# EAGLE design Arduino_Nano_Countdown_Timer_7-seg_CC (EAGLE 9.6.2)
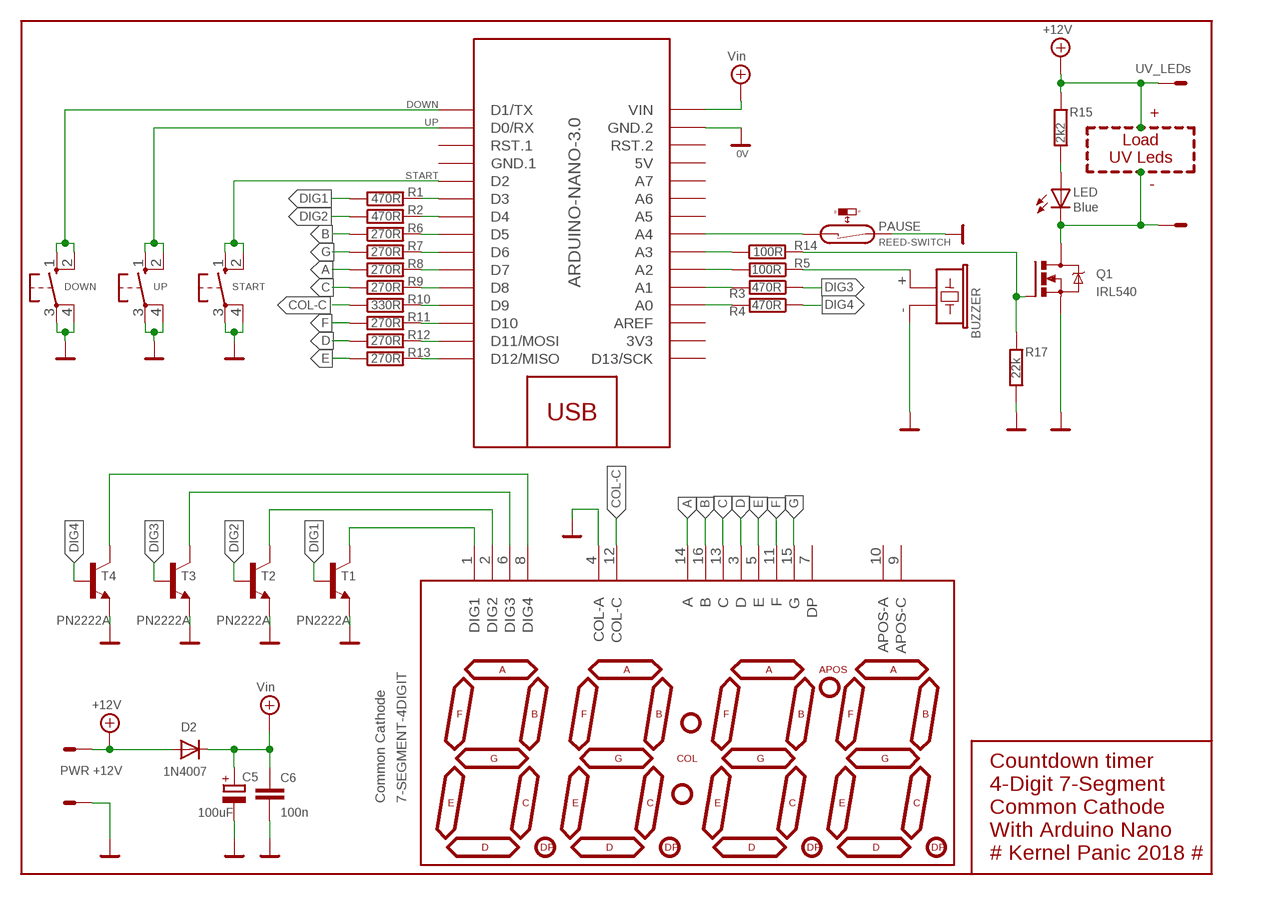
[diagram p0: schematic, sheet 1]

## Parts
BUZZER  F/CM12P  [F/CM12P]
C5  100uF  CAPACITOR_POLE5-6.5  [E5-6.5]
C6  100n  CAPACITOR050-025X075  [C050-025X075]
D2  1N4007  DIODE1N4004  [DO41-10]
DOWN  SWITCHE6K  [DTE6K]
LED  Blue  LED3MM  [LED3MM]
LED2  7-SEGMENT-4DIGIT  [7-SEGMENT-4DIGIT]
LOAD  UV_LEDs  22-23-2021  [22-23-2021]
M2  ARDUINO-NANO-3.0  [ARDUINO-NANO-3.0]
PAUSE  REED-SWITCH  REED-SWITCH-2PIN  [2PIN_HEADER]
PWR  PWR +12V  22-23-2021  [22-23-2021]
Q1  IRL540  IRF540  [TO220BV]
R1  470R  RESISTORR0805  [R0805]
R2  470R  RESISTORR0805  [R0805]
R3  470R  RESISTORR0805  [R0805]
R4  470R  RESISTORR0805  [R0805]
R5  100R  RESISTORR0805  [R0805]
R6  270R  RESISTORR0805  [R0805]
R7  270R  RESISTORR0805  [R0805]
R8  270R  RESISTORR0805  [R0805]
R9  270R  RESISTORR0805  [R0805]
R10  330R  RESISTORR0805  [R0805]
R11  270R  RESISTORR0805  [R0805]
R12  270R  RESISTORR0805  [R0805]
R13  270R  RESISTORR0805  [R0805]
R14  100R  RESISTOR0207/10-OCTAGON  [0207/10-8]
R15  2k2  RESISTORR0805  [R0805]
R17  22k  RESISTORR0805  [R0805]
START  SWITCHE6K  [DTE6K]
T1  PN2222A  2N2222  [TO92-EBC-OVAL]
T2  PN2222A  2N2222  [TO92-EBC-OVAL]
T3  PN2222A  2N2222  [TO92-EBC-OVAL]
T4  PN2222A  2N2222  [TO92-EBC-OVAL]
UP  SWITCHE6K  [DTE6K]

## Nets
0V: BUZZER.- C5.- C6.2 DOWN.3(P) DOWN.4(P) LED2.4(COL-A) M2.J2.2(GND.2) PAUSE.2 PWR.1 Q1.S R17.2 START.3(P) START.4(P) T1.E T2.E T3.E T4.E UP.3(P) UP.4(P)
+12V: D2.A LOAD.1 PWR.2 R15.1
A: LED2.14(A) R8.1
B: LED2.16(B) R6.1
BUZZER: BUZZER.+ R5.1
C: LED2.13(C) R9.1
COL-C: LED2.12(COL-C) R10.1
D: LED2.3(D) R12.1
DG1: LED2.1(DIG1) T1.C
DG2: LED2.2(DIG2) T2.C
DG3: LED2.6(DIG3) T3.C
DG4: LED2.8(DIG4) T4.C
DIG1: R1.1 T1.B
DIG2: R2.1 T2.B
DIG3: R3.1 T3.B
DIG4: R4.1 T4.B
DOWN: DOWN.1(S) DOWN.2(S) M2.J1.1(D1/TX)
DP: M2.J1.12(D9) R10.2
DRAIN: LED.K(C) LOAD.2 Q1.D
E: LED2.5(E) R13.1
F: LED2.11(F) R11.1
G: LED2.15(G) R7.1
GATE: Q1.G R14.2 R17.1
LED: LED.A R15.2
N$1: M2.J1.15(D12/MISO) R13.2
N$2: M2.J1.14(D11/MOSI) R12.2
N$3: M2.J2.10(A2) R5.2
N$4: M2.J2.9(A3) R14.1
N$5: M2.J1.13(D10) R11.2
N$6: M2.J1.6(D3) R1.2
N$12: M2.J2.11(A1) R3.2
N$13: M2.J1.7(D4) R2.2
N$14: M2.J2.8(A4) PAUSE.1
N$15: M2.J2.12(A0) R4.2
N$16: M2.J1.11(D8) R9.2
N$21: M2.J1.10(D7) R8.2
N$22: M2.J1.9(D6) R7.2
N$23: M2.J1.8(D5) R6.2
START: M2.J1.5(D2) START.1(S) START.2(S)
UP: M2.J1.2(D0/RX) UP.1(S) UP.2(S)
VIN: C5.+ C6.1 D2.C M2.J2.1(VIN) ; supply symbol labelled Vin
Unconnected: LED2.7(DP) LED2.9(APOS-C) LED2.10(APOS-A) M2.J1.3(RST.1) M2.J2.3(RST.2) M2.J2.5(A7) M2.J2.6(A6) M2.J2.7(A5) M2.J2.13(AREF) M2.J2.15(D13/SCK)

## Notes on the sheet
- +
- Load
  UV Leds
- -
- Common Cathode
- Countdown timer
  4-Digit 7-Segment
  Common Cathode
  With Arduino Nano
  # Kernel Panic 2018 #

## Power pins joined to a net without a drawn wire
3V3: M2.J2.14(3V3)
5V: M2.J2.4(5V)
GND.1: M2.J1.4(GND.1)

## Library data of the parts
BUZZER = buzzer:F/CM12P: BUZZER Source: Buerklin; OC_FARNELL: unknown; OC_NEWARK: unknown
C5 = 1_Stavros:CAPACITOR_POL: POLARIZED CAPACITOR, European symbol
C6 = 1_Stavros:CAPACITOR: CAPACITOR, European symbol
D2 = 1_Stavros:DIODE: Diode SMADIODE - SMA Surface Mount Package 20V 1A Schottky Diode Digikey: 641-1014-6-ND DO-1N4148 - Through Hole Small Current Diode SOD-123 20V 1 A (.5mV Vf) Schottky Diode - Digikey: MBRX120TPMSCT-ND SOD-323 10V 570mA (.38mV Vf, 3ns) Schottky Diode - Digikey: ZLLS410CT-ND SOD-523 30V 30mA Schottky Diode (RB751S-40TE61) - Digikey: RB751S-40TE61CT-ND SOT23-R/W - SOT23 Package (R = Solder Paste/Reflow Ovens, W = Hand-Soldering) BAT54Film 40V 300mA - Digikey: 497-7162-1-ND
DOWN START UP = 1_Stavros:SWITCH: ITT SWITCH
LED = 1_My_Library:LED: LED OSRAM: - CHIPLED LG R971, LG N971, LY N971, LG Q971, LY Q971, LO R971, LY R971 LH N974, LH R974 LS Q976, LO Q976, LY Q976 LO Q996 - Hyper CHIPLED LW Q18S LB Q993, LB Q99A, LB R99A - SideLED LS A670, LO A670, LY A670, LG A670, LP A670 LB A673, LV A673, LT A673, LW A673 LH A674 LY A675 LS A676, LA A676, LO A676, LY A676, LW A676 LS A679, LY A679, LG A679 - Hyper Micro SIDELED® LS Y876, LA Y876, LO Y876, LY Y876 LT Y87S - SmartLED LW L88C, LW L88S LB L89C, LB L89S, LG L890 LS L89K, LO L89K, LY L89K LS L896, LA L896, LO L896, LY L896 - TOPLED LS T670, LO T670, LY T670, LG T670, LP T670 LSG T670, LSP T670, LSY T670, LOP T670, LYG T670 LG T671, LOG T671, LSG T671 LB T673, LV T673, LT T673, LW T673 LH T674 LS T676, LA T676, LO T676, LY T676, LB T676, LH T676, LSB T676, LW T676 LB T67C, LV T67C, LT T67C, LS T67K, LO T67K, LY T67K, LW E67C LS E67B, LA E67B, LO E67B, LY E67B, LB E67C, LV E67C, LT E67C LW T67C LS T679, LY T679, LG T679 LS T770, LO T770, LY T770, LG T770, LP T770 LB T773, LV T773, LT T773, LW T773 LH T774 LS E675, LA E675, LY E675, LS T675 LS T776, LA T776, LO T776, LY T776, LB T776 LHGB T686 LT T68C, LB T68C - Hyper Mini TOPLED® LB M676 - Mini TOPLED Santana® LG M470 LS M47K, LO M47K, LY M47K Source: http://www.osram.convergy.de/
LED2 = 1_My_Library:7-SEGMENT-4DIGIT: This is a part for the 4-Digit 7-segment LEDs from Young Sun
LOAD PWR = Connector-Molex_Stavros:22-23-2021: .100" (2.54mm) Center Header - 2 Pin; MF: MOLEX; MPN: 22-23-2021; OC_FARNELL: 1462926; OC_NEWARK: 25C3832
M2 = diy-modules:ARDUINO-NANO-3.0: Arduino Nano 3.0
PAUSE = MY_Switch-misc:REED-SWITCH-: Reed Sensor
Q1 = transistor-power:IRF540: HEXFET Power MOSFET
R1-R15 = 1_My_Library:RESISTOR: RESISTOR, European symbol
R17 = 1_Stavros:RESISTOR: RESISTOR, European symbol
T1-T4 = 1_My_Library:2N2222: NPN TRANSISTOR Big oval pads

## Board
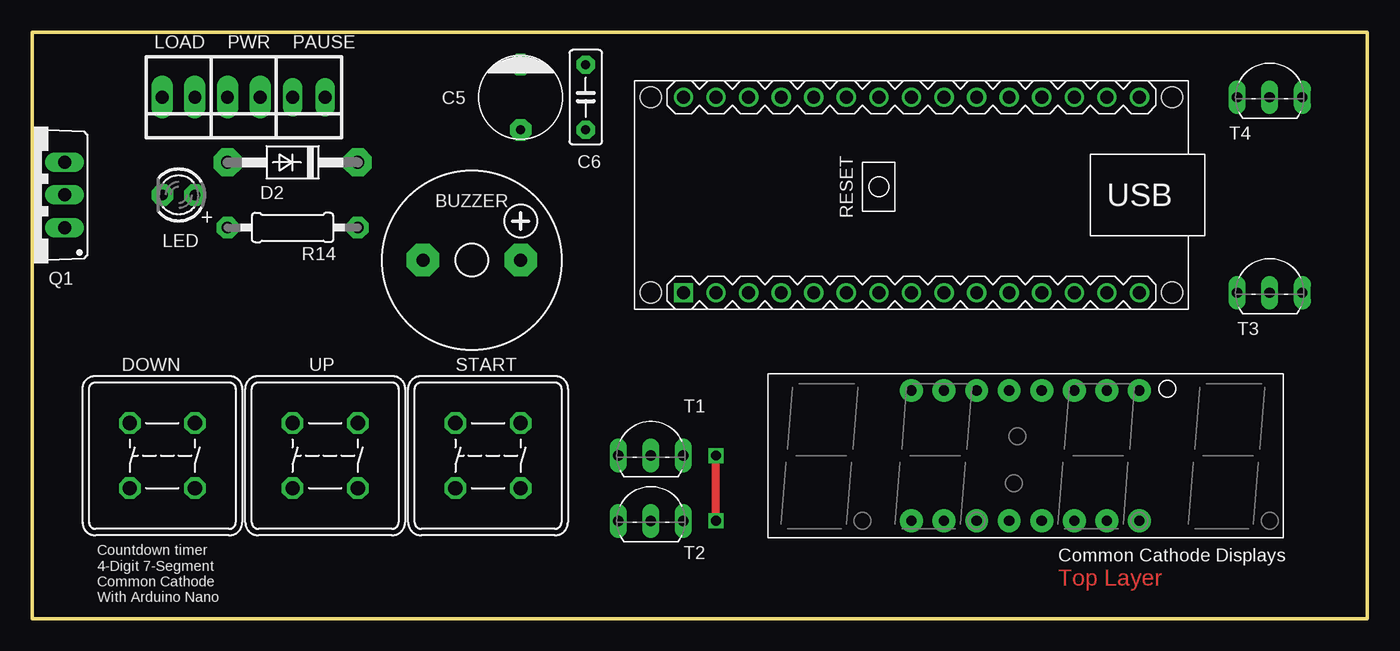
[diagram p1: board, top side]
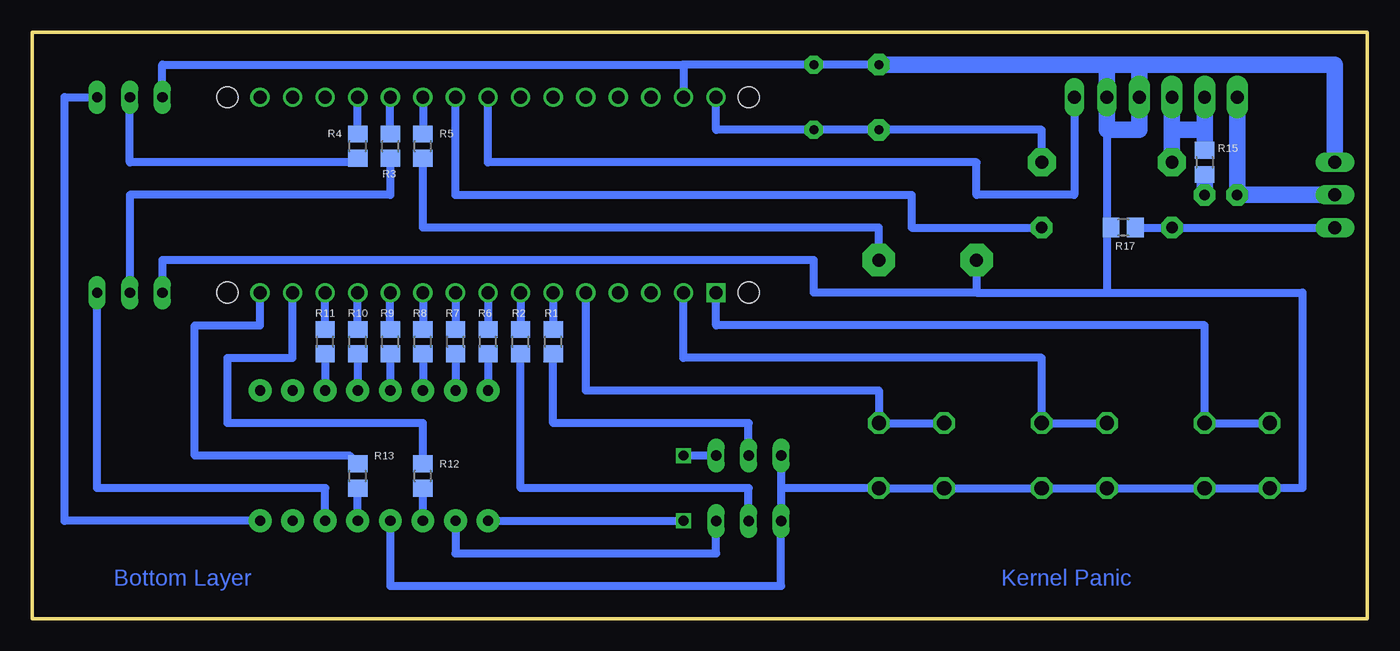
[diagram p2: board, bottom side, seen from below]

Size 104.14 x 45.72 mm. Coordinates in mm from the lower left corner, seen from the top.
Outline: 0,0 104.14,0 104.14,45.72 0,45.72 0,0
Copper layers (1*16): Top 0.035mm / dielectric 1.5mm / Bottom 0.035mm
Design rules "default": minimum track width 10mil, minimum drill 24mil, track to track 8mil, track to pad 8mil, pad to pad 8mil, via to via 8mil, smd to smd 8mil, copper to edge 40mil, drill to drill 8mil, minimum pad ring 10mil, minimum via ring 8mil, stop-mask expansion 4mil, vias tented up to drill 0mil, thermal gap 10mil

### Footprints (pad centres in the part's own frame; a part is rotated, then mirrored left to right if it is on the bottom)
F/CM12P = drill 1.016 pad 2.54 octagon: + 3.81,0; - -3.81,0
E5-6.5 = drill 0.7 pad 1.676 octagon: + -2.54,0; - 2.54,0
C050-025X075 = drill 0.7 pad 1.422 octagon: 1 -2.54,0; 2 2.54,0
DO41-10 = drill 1 pad 2.184 octagon: A 5.08,0; C -5.08,0
DTE6K = drill 1.118 octagon: 1 -2.54,2.54; 2 2.54,2.54; 3 2.54,-2.54; 4 -2.54,-2.54
LED3MM = drill 0.8 pad 1.676 octagon: A -1.27,0; K 1.27,0
7-SEGMENT-4DIGIT = drill 0.8 pad 1.778: 1 -8.89,-5.08; 2 -6.35,-5.08; 3 -3.81,-5.08; 4 -1.27,-5.08; 5 1.27,-5.08; 6 3.81,-5.08; 7 6.35,-5.08; 8 8.89,-5.08; 9 8.89,5.08; 10 6.35,5.08; 11 3.81,5.08; 12 1.27,5.08; 13 -1.27,5.08; 14 -3.81,5.08; 15 -6.35,5.08; 16 -8.89,5.08
22-23-2021 = drill 1 pad 1.676 long: 1 -1.27,0; 2 1.27,0
ARDUINO-NANO-3.0 = drill 1 square: J1.1 17.78,7.62 | drill 1: J1.2 15.24,7.62; J1.3 12.7,7.62; J1.4 10.16,7.62; J1.5 7.62,7.62; J1.6 5.08,7.62; J1.7 2.54,7.62; J1.8 0,7.62; J1.9 -2.54,7.62; J1.10 -5.08,7.62; J1.11 -7.62,7.62; J1.12 -10.16,7.62; J1.13 -12.7,7.62; J1.14 -15.24,7.62; J1.15 -17.78,7.62; J2.1 17.78,-7.62; J2.2 15.24,-7.62; J2.3 12.7,-7.62; J2.4 10.16,-7.62; J2.5 7.62,-7.62; J2.6 5.08,-7.62; J2.7 2.54,-7.62; J2.8 0,-7.62; J2.9 -2.54,-7.62; J2.10 -5.08,-7.62; J2.11 -7.62,-7.62; J2.12 -10.16,-7.62; J2.13 -12.7,-7.62; J2.14 -15.24,-7.62; J2.15 -17.78,-7.62 | hole 1.651: -20.32,7.62; -20.32,-7.62; 20.32,-7.62; 20.32,7.62
2PIN_HEADER = drill 1 long: 1 -1.27,0; 2 1.27,0
TO220BV = drill 1.016 long: D 0,-2.54; G -2.54,-2.54; S 2.54,-2.54
R0805 = smd 1.3 x 1.5: 1 -0.95,0; 2 0.95,0
0207/10-8 = drill 0.9 pad 1.676 octagon: 1 -5.08,0; 2 5.08,0
TO92-EBC-OVAL = drill 0.813 long: B 0,-1.27; C 2.54,-1.27; E -2.54,-1.27

### Placement (x,y rotation side)
BUZZER  34.29,27.94 0 top
C5  38.1,40.64 90 top
C6  43.18,40.64 90 top
D2  20.32,35.56 180 top
DOWN  10.16,12.7 0 top
LED  11.43,33.02 180 top
LED2  77.47,12.7 0 top
LOAD  11.43,40.64 180 top
M2  68.58,33.02 180 top
PAUSE  21.59,40.64 180 top
PWR  16.51,40.64 180 top
Q1  0,33.02 90 top
R1  63.5,21.59 90 bottom
R2  66.04,21.59 90 bottom
R3  76.2,36.83 90 bottom
R4  78.74,36.83 90 bottom
R5  73.66,36.83 90 bottom
R6  68.58,21.59 90 bottom
R7  71.12,21.59 90 bottom
R8  73.66,21.59 90 bottom
R9  76.2,21.59 90 bottom
R10  78.74,21.59 90 bottom
R11  81.28,21.59 90 bottom
R12  73.66,11.11 90 bottom
R13  78.74,11.11 90 bottom
R14  20.32,30.48 180 top
R15  12.7,35.56 270 bottom
R17  19.05,30.48 180 bottom
START  35.56,12.7 0 top
T1  48.26,13.97 0 top
T2  48.26,8.89 0 top
T3  96.52,26.67 0 top
T4  96.52,41.91 0 top
UP  22.86,12.7 0 top

### Tracks (layer width: path | path; a pad name or v marks a point on that pad's centre or on a via)
0V
  Bottom 0.61: C5.- C6.2 53.34,43.18 | T1.E 45.72,10.16 | 45.72,10.16 T2.E 45.72,2.54 76.2,2.54 LED2.4 | 45.72,10.16 START.3 START.4 UP.3 UP.4 DOWN.3 DOWN.4 5.08,10.16 5.08,25.4 20.32,25.4 | 53.34,43.18 M2.J2.2 | 20.32,38.1 20.32,30.48 | 20.32,30.48 20.32,30.16 | 20.32,30.16 20.32,25.4 | 30.48,25.4 20.32,25.4 | BUZZER.- 30.48,25.4 | 30.48,25.4 43.18,25.4 43.18,27.94 93.98,27.94 T3.E | T4.E 93.98,43.18 53.34,43.18 | 20.32,30.48 R17.2 20.32,30.16
  Bottom 1.27: Q1.S 2.54,43.18 17.78,43.18 | 17.78,43.18 20.32,43.18 | 20.32,43.18 C5.- | 20.32,43.18 PAUSE.2 20.32,38.1 17.78,38.1 PWR.1 17.78,43.18
+12V
  Bottom 1.27: R15.1 12.7,38.1 | 12.7,38.1 LOAD.1 | PWR.2 15.24,38.1 | 15.24,38.1 D2.A | 12.7,38.1 15.24,38.1
A
  Bottom 0.61: R8.1 LED2.14
B
  Bottom 0.61: R6.1 LED2.16
BUZZER
  Bottom 0.61: R5.1 73.66,30.48 38.1,30.48 BUZZER.+
C
  Bottom 0.61: R9.1 LED2.13
COL-C
  Bottom 0.61: R10.1 LED2.12
D
  Bottom 0.61: LED2.3 R12.1
DG1  (via drill 0.75)
  Top 0.61: v53.34,7.62 v53.34,12.7
  Bottom 0.61: LED2.1 v53.34,7.62 | T1.C v53.34,12.7
DG2
  Bottom 0.61: LED2.2 71.12,5.08 50.8,5.08 T2.C
DG3
  Bottom 0.61: LED2.6 81.28,10.16 99.06,10.16 T3.C
DG4
  Bottom 0.61: LED2.8 101.6,7.62 101.6,40.64 T4.C
DIG1
  Bottom 0.61: T1.B 48.26,15.24 63.5,15.24 R1.1
DIG2
  Bottom 0.61: T2.B 48.26,10.16 66.04,10.16 R2.1
DIG3
  Bottom 0.61: R3.1 76.2,33.02 96.52,33.02 T3.B
DIG4
  Bottom 0.61: R4.1 79.06,35.56 96.52,35.56 T4.B
DOWN
  Bottom 0.61: M2.J1.1 50.8,22.86 12.7,22.86 DOWN.2 DOWN.1
DP
  Bottom 0.61: R10.2 M2.J1.12
DRAIN
  Bottom 1.27: LOAD.2 LED.K Q1.D
E
  Bottom 0.61: LED2.5 R13.1
F
  Bottom 0.61: R11.1 LED2.11
G
  Bottom 0.61: R7.1 LED2.15
GATE
  Bottom 0.61: Q1.G R14.2 R17.1
LED
  Bottom 1.27: LED.A R15.2
N$1
  Bottom 0.61: R13.2 79.38,12.7 91.44,12.7 91.44,22.86 86.36,22.86 M2.J1.15
N$2
  Bottom 0.61: R12.2 73.66,15.24 88.9,15.24 88.9,20.32 83.82,20.32 M2.J1.14
N$3
  Bottom 0.61: M2.J2.10 R5.2
N$4
  Bottom 0.61: M2.J2.9 71.12,33.02 35.56,33.02 35.56,30.48 R14.1
N$5
  Bottom 0.61: R11.2 M2.J1.13
N$6
  Bottom 0.61: M2.J1.6 R1.2
N$12
  Bottom 0.61: R3.2 M2.J2.11
N$13
  Bottom 0.61: M2.J1.7 R2.2
N$14
  Bottom 0.61: PAUSE.1 22.86,33.02 30.48,33.02 30.48,35.56 68.58,35.56 M2.J2.8
N$15
  Bottom 0.61: R4.2 M2.J2.12
N$16
  Bottom 0.61: R9.2 M2.J1.11
N$21
  Bottom 0.61: M2.J1.10 R8.2
N$22
  Bottom 0.61: M2.J1.9 R7.2
N$23
  Bottom 0.61: M2.J1.8 R6.2
START
  Bottom 0.61: M2.J1.5 60.96,17.78 38.1,17.78 START.2 START.1
UP
  Bottom 0.61: M2.J1.2 53.34,20.32 25.4,20.32 UP.2 UP.1
VIN
  Bottom 0.61: M2.J2.1 50.8,38.1 C6.1 C5.+ 25.4,38.1 D2.C

### Text on the board
Top: Top Layer
Bottom: Kernel Panic | Bottom Layer
tPlace: Countdown timer / 4-Digit 7-Segment / Common Cathode / With Arduino Nano
tNames: Common Cathode Displays